# Altium project pico_host_board_v01.PrjPcb
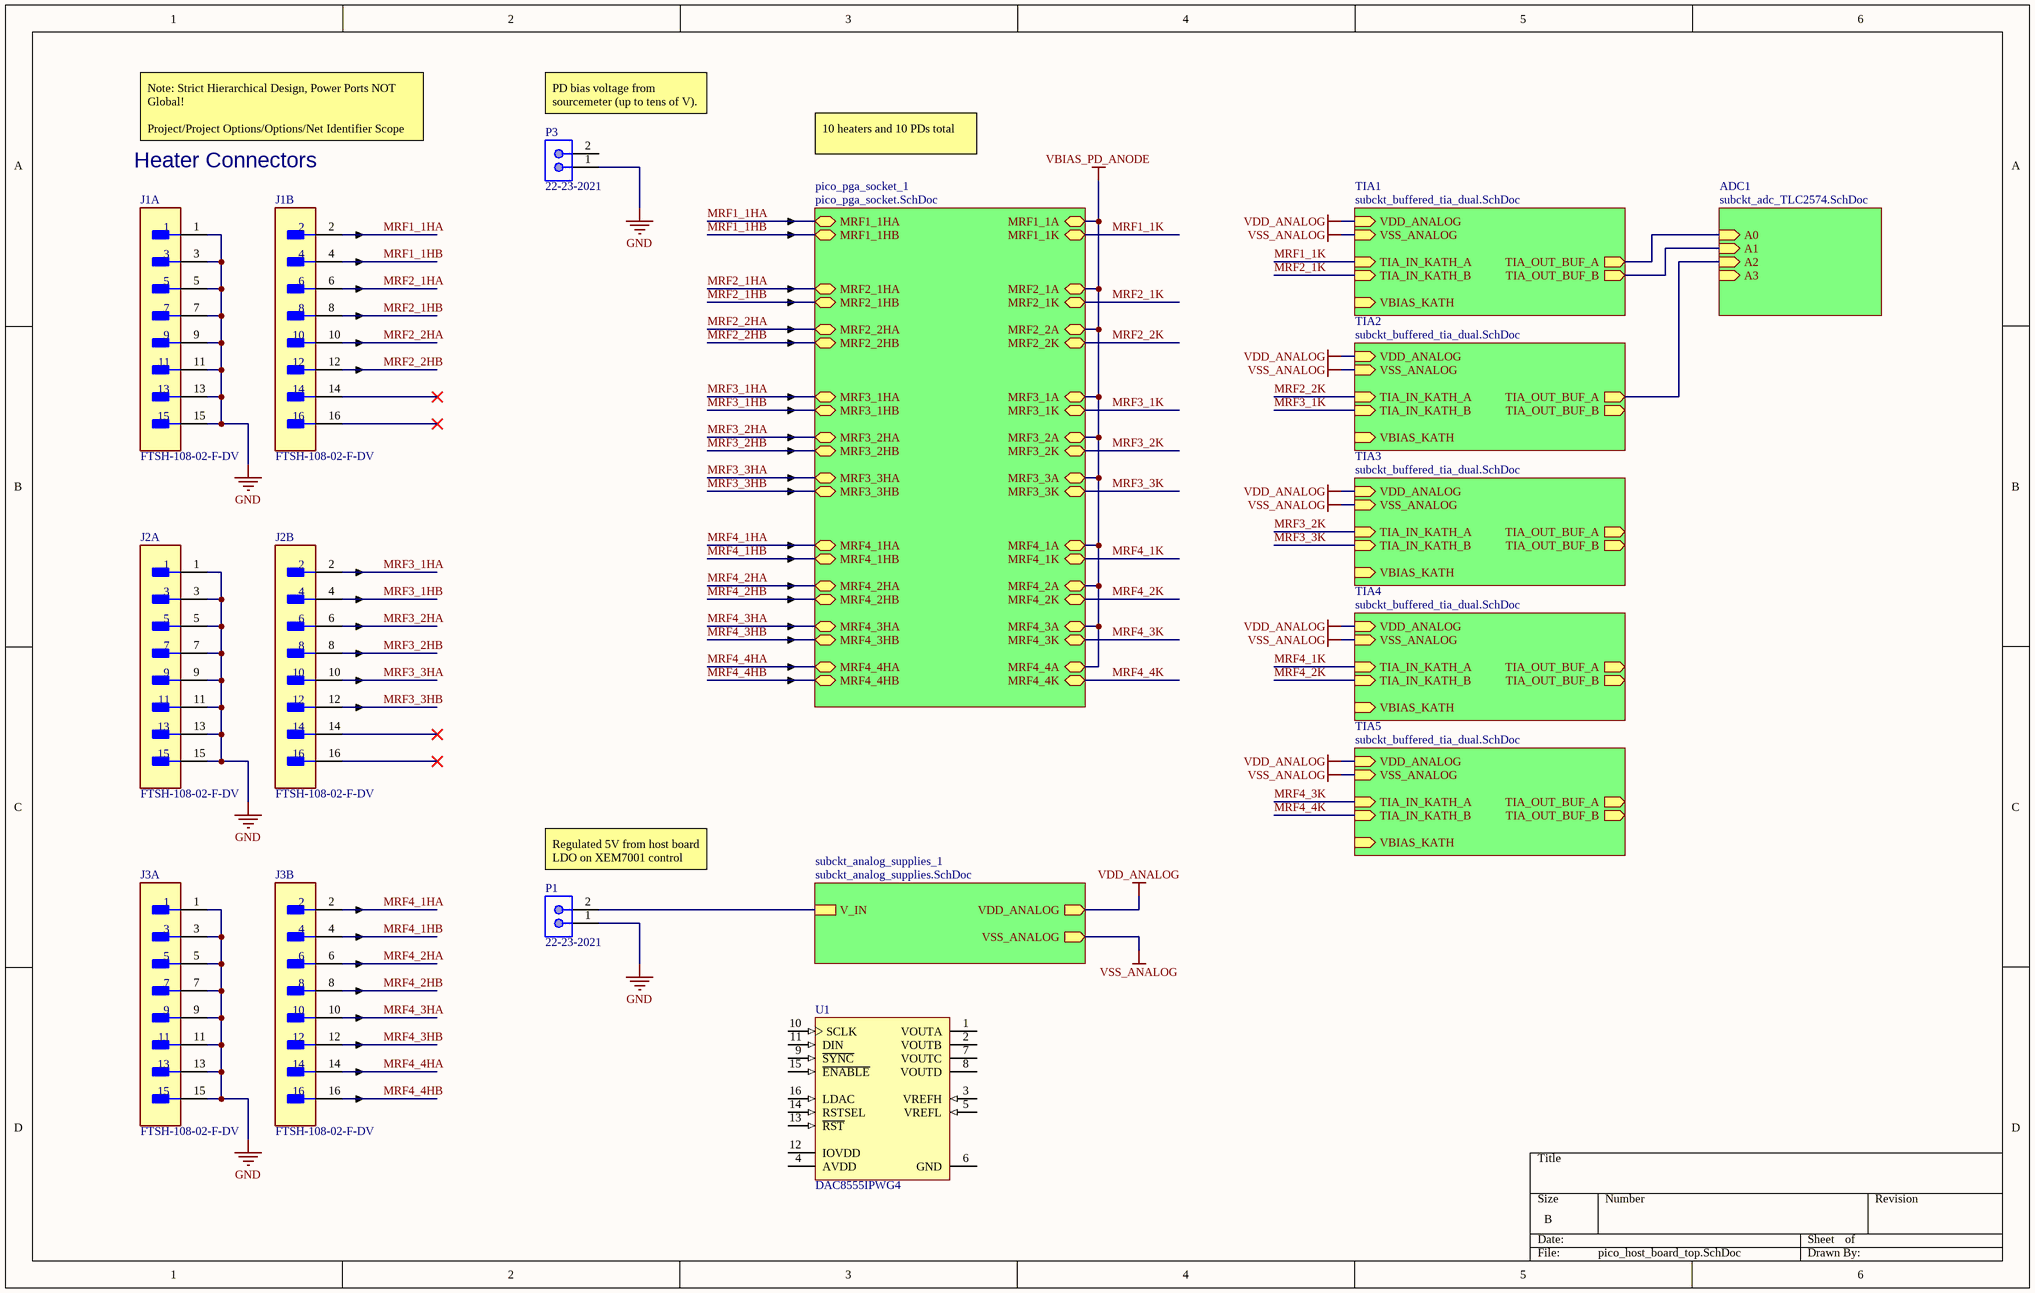
[diagram p0: pico_host_board_top.SchDoc]
2 sheets, 7 parts. Net scope: hierarchical (ports join the sheet entries above them; power ports are global).
Board file: pico_host_board_v01_top.PcbDoc
Sheets:
  pico_host_board_top.SchDoc
    pico_pga_socket_1 = pico_pga_socket.SchDoc

## Sheet pico_host_board_top.SchDoc
size B; SheetNumber: 1; SheetTotal: 2

### Parts
J1  FTSH-108-02-F-DV  [LIBRARYSOURCE=Vault|VAULTGUID=B7D15EC3-160A-466F-A46C-7801FE6295A7|REVISIONGUID=4386816A-B426-492F-A73C-09950B70C106|FOOTPRINT=FP-FTSH-108-02-F-DV]  (parts A,B of 2)
J2  FTSH-108-02-F-DV  [LIBRARYSOURCE=Vault|VAULTGUID=B7D15EC3-160A-466F-A46C-7801FE6295A7|REVISIONGUID=4386816A-B426-492F-A73C-09950B70C106|FOOTPRINT=FP-FTSH-108-02-F-DV]  (parts A,B of 2)
J3  FTSH-108-02-F-DV  [LIBRARYSOURCE=Vault|VAULTGUID=B7D15EC3-160A-466F-A46C-7801FE6295A7|REVISIONGUID=4386816A-B426-492F-A73C-09950B70C106|FOOTPRINT=FP-FTSH-108-02-F-DV]  (parts A,B of 2)
P1  22-23-2021  [MOLX-22-23-2021_V]
P3  22-23-2021  [MOLX-22-23-2021_V]
U1  DAC8555IPWG4  [TI-PW16_L]

### Sub-sheets
ADC1 = subckt_adc_TLC2574.SchDoc (file not in this document): A0 (in), A1 (in), A2 (in), A3 (in)
pico_pga_socket_1 = pico_pga_socket.SchDoc: MRF1_1HA (bidir), MRF1_1HB (bidir), MRF2_1HA (bidir), MRF2_1HB (bidir), MRF2_2HA (bidir), MRF2_2HB (bidir), MRF3_1HA (bidir), MRF3_1HB (bidir), MRF3_2HA (bidir), MRF3_2HB (bidir), MRF3_3HA (bidir), MRF3_3HB (bidir), MRF4_1HA (bidir), MRF4_1HB (bidir), MRF4_2HA (bidir), MRF4_2HB (bidir), MRF4_3HA (bidir), MRF4_3HB (bidir), MRF4_4HA (bidir), MRF4_4HB (bidir), MRF1_1A (bidir), MRF1_1K (bidir), MRF2_1A (bidir), MRF2_1K (bidir), MRF2_2A (bidir), MRF2_2K (bidir), MRF3_1A (bidir), MRF3_1K (bidir), MRF3_2A (bidir), MRF3_2K (bidir), MRF3_3A (bidir), MRF3_3K (bidir), MRF4_1A (bidir), MRF4_1K (bidir), MRF4_2A (bidir), MRF4_2K (bidir), MRF4_3A (bidir), MRF4_3K (bidir), MRF4_4A (bidir), MRF4_4K (bidir)
subckt_analog_supplies_1 = subckt_analog_supplies.SchDoc (file not in this document): V_IN, VDD_ANALOG (out), VSS_ANALOG (out)
TIA1 = subckt_buffered_tia_dual.SchDoc (file not in this document): VDD_ANALOG (in), VSS_ANALOG (in), TIA_IN_KATH_A (in), VBIAS_KATH (in), TIA_OUT_BUF_A (out), TIA_IN_KATH_B (in), TIA_OUT_BUF_B (out)
TIA2 = subckt_buffered_tia_dual.SchDoc (file not in this document): VDD_ANALOG (in), VSS_ANALOG (in), TIA_IN_KATH_A (in), VBIAS_KATH (in), TIA_OUT_BUF_A (out), TIA_IN_KATH_B (in), TIA_OUT_BUF_B (out)
TIA3 = subckt_buffered_tia_dual.SchDoc (file not in this document): VDD_ANALOG (in), VSS_ANALOG (in), TIA_IN_KATH_A (in), VBIAS_KATH (in), TIA_OUT_BUF_A (out), TIA_IN_KATH_B (in), TIA_OUT_BUF_B (out)
TIA4 = subckt_buffered_tia_dual.SchDoc (file not in this document): VDD_ANALOG (in), VSS_ANALOG (in), TIA_IN_KATH_A (in), VBIAS_KATH (in), TIA_OUT_BUF_A (out), TIA_IN_KATH_B (in), TIA_OUT_BUF_B (out)
TIA5 = subckt_buffered_tia_dual.SchDoc (file not in this document): VDD_ANALOG (in), VSS_ANALOG (in), TIA_IN_KATH_A (in), VBIAS_KATH (in), TIA_OUT_BUF_A (out), TIA_IN_KATH_B (in), TIA_OUT_BUF_B (out)

### Nets
GND: J1.1 J1.3 J1.5 J1.7 J1.9 J1.11 J1.13 J1.15 J2.1 J2.3 J2.5 J2.7 J2.9 J2.11 J2.13 J2.15 J3.1 J3.3 J3.5 J3.7 J3.9 J3.11 J3.13 J3.15 P1.1 P3.1
VBIAS_PD_ANODE: sheet pico_pga_socket_1/MRF1_1A, sheet pico_pga_socket_1/MRF2_1A, sheet pico_pga_socket_1/MRF2_2A, sheet pico_pga_socket_1/MRF3_1A, sheet pico_pga_socket_1/MRF3_2A, sheet pico_pga_socket_1/MRF3_3A, sheet pico_pga_socket_1/MRF4_1A, sheet pico_pga_socket_1/MRF4_2A, sheet pico_pga_socket_1/MRF4_3A, sheet pico_pga_socket_1/MRF4_4A
VDD_ANALOG: sheet subckt_analog_supplies_1/VDD_ANALOG, sheet TIA1/VDD_ANALOG, sheet TIA2/VDD_ANALOG, sheet TIA3/VDD_ANALOG, sheet TIA4/VDD_ANALOG, sheet TIA5/VDD_ANALOG
VSS_ANALOG: sheet subckt_analog_supplies_1/VSS_ANALOG, sheet TIA1/VSS_ANALOG, sheet TIA2/VSS_ANALOG, sheet TIA3/VSS_ANALOG, sheet TIA4/VSS_ANALOG, sheet TIA5/VSS_ANALOG
MRF1_1HA: J1.2 ; sheet pico_pga_socket_1/MRF1_1HA
MRF1_1HB: J1.4 ; sheet pico_pga_socket_1/MRF1_1HB
MRF1_1K: sheet pico_pga_socket_1/MRF1_1K, sheet TIA1/TIA_IN_KATH_A
MRF2_1HA: J1.6 ; sheet pico_pga_socket_1/MRF2_1HA
MRF2_1HB: J1.8 ; sheet pico_pga_socket_1/MRF2_1HB
MRF2_1K: sheet pico_pga_socket_1/MRF2_1K, sheet TIA1/TIA_IN_KATH_B
MRF2_2HA: J1.10 ; sheet pico_pga_socket_1/MRF2_2HA
MRF2_2HB: J1.12 ; sheet pico_pga_socket_1/MRF2_2HB
MRF2_2K: sheet pico_pga_socket_1/MRF2_2K, sheet TIA2/TIA_IN_KATH_A
MRF3_1HA: J2.2 ; sheet pico_pga_socket_1/MRF3_1HA
MRF3_1HB: J2.4 ; sheet pico_pga_socket_1/MRF3_1HB
MRF3_1K: sheet pico_pga_socket_1/MRF3_1K, sheet TIA2/TIA_IN_KATH_B
MRF3_2HA: J2.6 ; sheet pico_pga_socket_1/MRF3_2HA
MRF3_2HB: J2.8 ; sheet pico_pga_socket_1/MRF3_2HB
MRF3_2K: sheet pico_pga_socket_1/MRF3_2K, sheet TIA3/TIA_IN_KATH_A
MRF3_3HA: J2.10 ; sheet pico_pga_socket_1/MRF3_3HA
MRF3_3HB: J2.12 ; sheet pico_pga_socket_1/MRF3_3HB
MRF3_3K: sheet pico_pga_socket_1/MRF3_3K, sheet TIA3/TIA_IN_KATH_B
MRF4_1HA: J3.2 ; sheet pico_pga_socket_1/MRF4_1HA
MRF4_1HB: J3.4 ; sheet pico_pga_socket_1/MRF4_1HB
MRF4_1K: sheet pico_pga_socket_1/MRF4_1K, sheet TIA4/TIA_IN_KATH_A
MRF4_2HA: J3.6 ; sheet pico_pga_socket_1/MRF4_2HA
MRF4_2HB: J3.8 ; sheet pico_pga_socket_1/MRF4_2HB
MRF4_2K: sheet pico_pga_socket_1/MRF4_2K, sheet TIA4/TIA_IN_KATH_B
MRF4_3HA: J3.10 ; sheet pico_pga_socket_1/MRF4_3HA
MRF4_3HB: J3.12 ; sheet pico_pga_socket_1/MRF4_3HB
MRF4_3K: sheet pico_pga_socket_1/MRF4_3K, sheet TIA5/TIA_IN_KATH_A
MRF4_4HA: J3.14 ; sheet pico_pga_socket_1/MRF4_4HA
MRF4_4HB: J3.16 ; sheet pico_pga_socket_1/MRF4_4HB
MRF4_4K: sheet pico_pga_socket_1/MRF4_4K, sheet TIA5/TIA_IN_KATH_B
NetP1_2: P1.2 ; sheet subckt_analog_supplies_1/V_IN
(unnamed): sheet TIA1/TIA_OUT_BUF_A, sheet ADC1/A0
(unnamed): sheet TIA1/TIA_OUT_BUF_B, sheet ADC1/A1
(unnamed): sheet TIA2/TIA_OUT_BUF_A, sheet ADC1/A2

Not connected (* = marked no-connect by the designer): J1 14* 16*; J2 14* 16*; P3 2; U1 1(VOUTA) 2(VOUTB) 3(VREFH) 4(AVDD) 5(VREFL) 6(GND) 7(VOUTC) 8(VOUTD) 9(~{SYNC}) 10(SCLK) 11(DIN) 12(IOVDD) 13(~{RST}) 14(RSTSEL) 15(~{ENABLE}) 16(LDAC)

### Notes on the sheet
- Note: Strict Hierarchical Design, Power Ports NOT Global!
  Project/Project Options/Options/Net Identifier Scope
- (near P3) PD bias voltage from sourcemeter (up to tens of V).
- 10 heaters and 10 PDs total
- Heater Connectors
- (near P1) Regulated 5V from host board LDO on XEM7001 control board.

### Library data of the parts
J1-J3 = FP-FTSH-108-02-F-DV: CONN HEADER SMD 16POS 1.27MM; Manufacturer: Samtec; Standoff Height: 0.46mm; Conn Orientation: Vertical; Current Rating: 3.4A; Number Of Contacts: 16; Conn Gender: Male; Lead Free: Yes; Package: FTSH-108-02-F-DV; Footprint Url: http://suddendocs.samtec.com/prints/ftsh-1xx-xx-xxx-dv-xxx-footprint.pdf; Automotive: No; Pitch: 1.27mm; Manufacturer Part Number: FTSH-108-02-F-DV; Device Class L2: Headers and Wire Housings; ComponentLink2URL: http://suddendocs.samtec.com/prints/ftsh-1xx-xx-xxx-dv-xxx-xxx-mkt.pdf; ComponentLink2Description: Datasheet; Octopart: https://octopart.com/ftsh-108-02-f-dv-samtec-10605893; RoHS: TRUE; Digikey Description: CONN HEADER SMD 16POS 1.27MM; Device Class L1: Connectors; Temperature Range High: +125°C; Temperature: -55°C to +125°C; Device Class L3: unset; Category: Conn; Temperature Range Low: -55°C; Number Of Rows: 2; Contact Material: Gold,Nickel; Mouser Description: Conn Unshrouded Header HDR 16 POS 1.27mm Solder ST SMD Tube; Height: 5.09mm
P1 P3 = CMP-1704-00001-3: Male Header, Pitch 2.54 mm, 1 x 2 Position, Height 10.67 mm, Tail Length 3.56 mm, 0 to 75 degC, RoHS, Bulk; Package Quantity: 3000; Height: 10.67 mm; RoHSCompliant: True; ComponentLink2URL: https://datasheet.ciiva.com/19454/232266-19454304.pdf; PartNumber: 22-23-2021; Packaging: Bulk; ComponentLink2Description: Datasheet; Min Operating Temperature: 0 degC; ComponentLink1Description: Manufacturer URL; Length: 5.08 mm; Mounting Technology: Through Hole; Max Operating Temperature: 75 degC; REACH SVHC: Unknown; PackageDescription: Male Header, Pitch 2.54 mm, 1 x 2 Position, Height 10.67 mm, Tail Length 3.56 mm; ComponentLink1URL: http://www.molex.com/; Mount: Through Hole; Radiation Hardening: No; Width: 6.35 mm; Pins: 2
U1 = CMP-0004-01174-1: 16-Bit, Quad Channel, Ultralow Glitch, Voltage Output Digital to Analog Converter, -40 to 105 degC, 16-pin SOP (PW16), Green (RoHS & no Sb/Br); Manufacturer: Texas Instruments; SubFamily: Precision DAC (=<10MSPS); Resolution(Bits): 16; SNR(dB): 95; Interface: Serial SPI; SFDR(dB): 87; DAC Channels: 4; Settling Time(us): 10; DNL(Max)(+/-LSB): 1; ComponentLink2Description: Datasheet; PackageReference: PW16; PackageVersion: 4040064-4/G, 02/2011; ComponentLink3Description: Package Specification; Code_JEDEC: MO-153; Eco-Plan: Green (RoHS & no Sb/Br); Mounting Technology: Surface Mount; DatasheetVersion: SLAS475B; PackageDescription: 16-Pin Plastic Small Outline, Body 5 x 4.4 mm, Pitch 0.65 mm; ComponentLink1Description: Manufacturer URL; ComponentLink1URL: http://www.ti.com/; ComponentLink3URL: http://www.ti.com/lit/ml/mpds361/mpds361.pdf; PartNumber: DAC8555IPWG4; ComponentLink2URL: http://www.ti.com/general/docs/lit/getliterature.tsp?genericPartNumber=DAC8555&fileType=pdf

## Sheet pico_pga_socket.SchDoc
size B; SheetNumber: 2; SheetTotal: 2
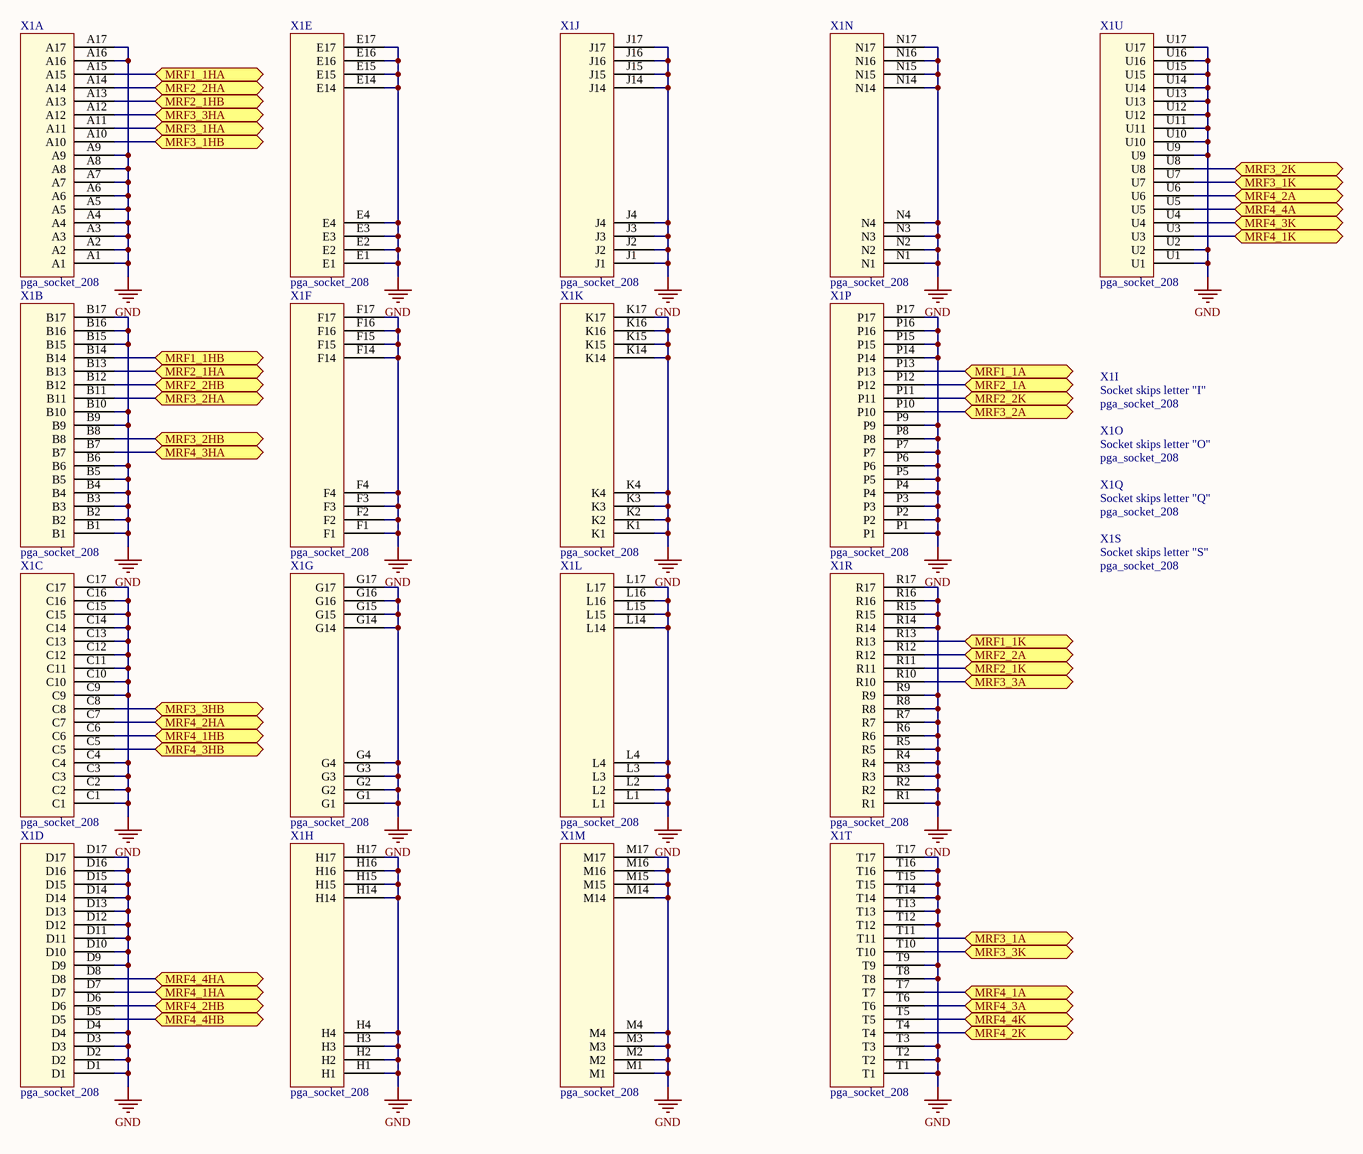
[diagram p1: pico_pga_socket.SchDoc]

### Parts
X1  pga_socket_208  [pga_socket_208pin_17x17_minus_9x9]  (parts A,B,C,D,E,F,G,H,I,J,K,L,M,N,O,P,Q,R,S,T,U of 21)

### Ports
MRF1_1A (bidir), MRF1_1HA (bidir), MRF1_1HB (bidir), MRF1_1K (bidir), MRF2_1A (bidir), MRF2_1HA (bidir), MRF2_1HB (bidir), MRF2_1K (bidir), MRF2_2A (bidir), MRF2_2HA (bidir), MRF2_2HB (bidir), MRF2_2K (bidir), MRF3_1A (bidir), MRF3_1HA (bidir), MRF3_1HB (bidir), MRF3_1K (bidir), MRF3_2A (bidir), MRF3_2HA (bidir), MRF3_2HB (bidir), MRF3_2K (bidir), MRF3_3A (bidir), MRF3_3HA (bidir), MRF3_3HB (bidir), MRF3_3K (bidir), MRF4_1A (bidir), MRF4_1HA (bidir), MRF4_1HB (bidir), MRF4_1K (bidir), MRF4_2A (bidir), MRF4_2HA (bidir), MRF4_2HB (bidir), MRF4_2K (bidir), MRF4_3A (bidir), MRF4_3HA (bidir), MRF4_3HB (bidir), MRF4_3K (bidir), MRF4_4A (bidir), MRF4_4HA (bidir), MRF4_4HB (bidir), MRF4_4K (bidir)

### Nets
GND: X1.A1 X1.A2 X1.A3 X1.A4 X1.A5 X1.A6 X1.A7 X1.A8 X1.A9 X1.A16 X1.A17 X1.B1 X1.B2 X1.B3 X1.B4 X1.B5 X1.B6 X1.B9 X1.B10 X1.B15 X1.B16 X1.B17 X1.C1 X1.C2 X1.C3 X1.C4 X1.C9 X1.C10 X1.C11 X1.C12 X1.C13 X1.C14 X1.C15 X1.C16 X1.C17 X1.D1 X1.D2 X1.D3 X1.D4 X1.D9 X1.D10 X1.D11 X1.D12 X1.D13 X1.D14 X1.D15 X1.D16 X1.D17 X1.E1 X1.E2 X1.E3 X1.E4 X1.E14 X1.E15 X1.E16 X1.E17 X1.F1 X1.F2 X1.F3 X1.F4 X1.F14 X1.F15 X1.F16 X1.F17 X1.G1 X1.G2 X1.G3 X1.G4 X1.G14 X1.G15 X1.G16 X1.G17 X1.H1 X1.H2 X1.H3 X1.H4 X1.H14 X1.H15 X1.H16 X1.H17 X1.J1 X1.J2 X1.J3 X1.J4 X1.J14 X1.J15 X1.J16 X1.J17 X1.K1 X1.K2 X1.K3 X1.K4 X1.K14 X1.K15 X1.K16 X1.K17 X1.L1 X1.L2 X1.L3 X1.L4 X1.L14 X1.L15 X1.L16 X1.L17 X1.M1 X1.M2 X1.M3 X1.M4 X1.M14 X1.M15 X1.M16 X1.M17 X1.N1 X1.N2 X1.N3 X1.N4 X1.N14 X1.N15 X1.N16 X1.N17 X1.P1 X1.P2 X1.P3 X1.P4 X1.P5 X1.P6 X1.P7 X1.P8 X1.P9 X1.P14 X1.P15 X1.P16 X1.P17 X1.R1 X1.R2 X1.R3 X1.R4 X1.R5 X1.R6 X1.R7 X1.R8 X1.R9 X1.R14 X1.R15 X1.R16 X1.R17 X1.T1 X1.T2 X1.T3 X1.T8 X1.T9 X1.T12 X1.T13 X1.T14 X1.T15 X1.T16 X1.T17 X1.U1 X1.U2 X1.U9 X1.U10 X1.U11 X1.U12 X1.U13 X1.U14 X1.U15 X1.U16 X1.U17
VBIAS_PD_ANODE: X1.P10 X1.P12 X1.P13 X1.R10 X1.R12 X1.T6 X1.T7 X1.T11 X1.U5 X1.U6 ; port MRF1_1A, port MRF2_1A, port MRF2_2A, port MRF3_1A, port MRF3_2A, port MRF3_3A, port MRF4_1A, port MRF4_2A, port MRF4_3A, port MRF4_4A
MRF1_1HA: X1.A15 ; port MRF1_1HA
MRF1_1HB: X1.B14 ; port MRF1_1HB
MRF1_1K: X1.R13 ; port MRF1_1K
MRF2_1HA: X1.B13 ; port MRF2_1HA
MRF2_1HB: X1.A13 ; port MRF2_1HB
MRF2_1K: X1.R11 ; port MRF2_1K
MRF2_2HA: X1.A14 ; port MRF2_2HA
MRF2_2HB: X1.B12 ; port MRF2_2HB
MRF2_2K: X1.P11 ; port MRF2_2K
MRF3_1HA: X1.A11 ; port MRF3_1HA
MRF3_1HB: X1.A10 ; port MRF3_1HB
MRF3_1K: X1.U7 ; port MRF3_1K
MRF3_2HA: X1.B11 ; port MRF3_2HA
MRF3_2HB: X1.B8 ; port MRF3_2HB
MRF3_2K: X1.U8 ; port MRF3_2K
MRF3_3HA: X1.A12 ; port MRF3_3HA
MRF3_3HB: X1.C8 ; port MRF3_3HB
MRF3_3K: X1.T10 ; port MRF3_3K
MRF4_1HA: X1.D7 ; port MRF4_1HA
MRF4_1HB: X1.C6 ; port MRF4_1HB
MRF4_1K: X1.U3 ; port MRF4_1K
MRF4_2HA: X1.C7 ; port MRF4_2HA
MRF4_2HB: X1.D6 ; port MRF4_2HB
MRF4_2K: X1.T4 ; port MRF4_2K
MRF4_3HA: X1.B7 ; port MRF4_3HA
MRF4_3HB: X1.C5 ; port MRF4_3HB
MRF4_3K: X1.U4 ; port MRF4_3K
MRF4_4HA: X1.D8 ; port MRF4_4HA
MRF4_4HB: X1.D5 ; port MRF4_4HB
MRF4_4K: X1.T5 ; port MRF4_4K

### Notes on the sheet
- (in symbol pga_socket_208, part I) Socket skips letter "I"
- (in symbol pga_socket_208, part O) Socket skips letter "O"
- (in symbol pga_socket_208, part Q) Socket skips letter "Q"
- (in symbol pga_socket_208, part S) Socket skips letter "S"

## Nets that join several sheets
GND: pico_host_board_top (26 pins), pico_pga_socket (168 pins)
MRF1_1HA: pico_host_board_top (J1.2), pico_pga_socket (X1.A15)
MRF1_1HB: pico_host_board_top (J1.4), pico_pga_socket (X1.B14)
MRF2_1HA: pico_host_board_top (J1.6), pico_pga_socket (X1.B13)
MRF2_1HB: pico_host_board_top (J1.8), pico_pga_socket (X1.A13)
MRF2_2HA: pico_host_board_top (J1.10), pico_pga_socket (X1.A14)
MRF2_2HB: pico_host_board_top (J1.12), pico_pga_socket (X1.B12)
MRF3_1HA: pico_host_board_top (J2.2), pico_pga_socket (X1.A11)
MRF3_1HB: pico_host_board_top (J2.4), pico_pga_socket (X1.A10)
MRF3_2HA: pico_host_board_top (J2.6), pico_pga_socket (X1.B11)
MRF3_2HB: pico_host_board_top (J2.8), pico_pga_socket (X1.B8)
MRF3_3HA: pico_host_board_top (J2.10), pico_pga_socket (X1.A12)
MRF3_3HB: pico_host_board_top (J2.12), pico_pga_socket (X1.C8)
MRF4_1HA: pico_host_board_top (J3.2), pico_pga_socket (X1.D7)
MRF4_1HB: pico_host_board_top (J3.4), pico_pga_socket (X1.C6)
MRF4_2HA: pico_host_board_top (J3.6), pico_pga_socket (X1.C7)
MRF4_2HB: pico_host_board_top (J3.8), pico_pga_socket (X1.D6)
MRF4_3HA: pico_host_board_top (J3.10), pico_pga_socket (X1.B7)
MRF4_3HB: pico_host_board_top (J3.12), pico_pga_socket (X1.C5)
MRF4_4HA: pico_host_board_top (J3.14), pico_pga_socket (X1.D8)
MRF4_4HB: pico_host_board_top (J3.16), pico_pga_socket (X1.D5)